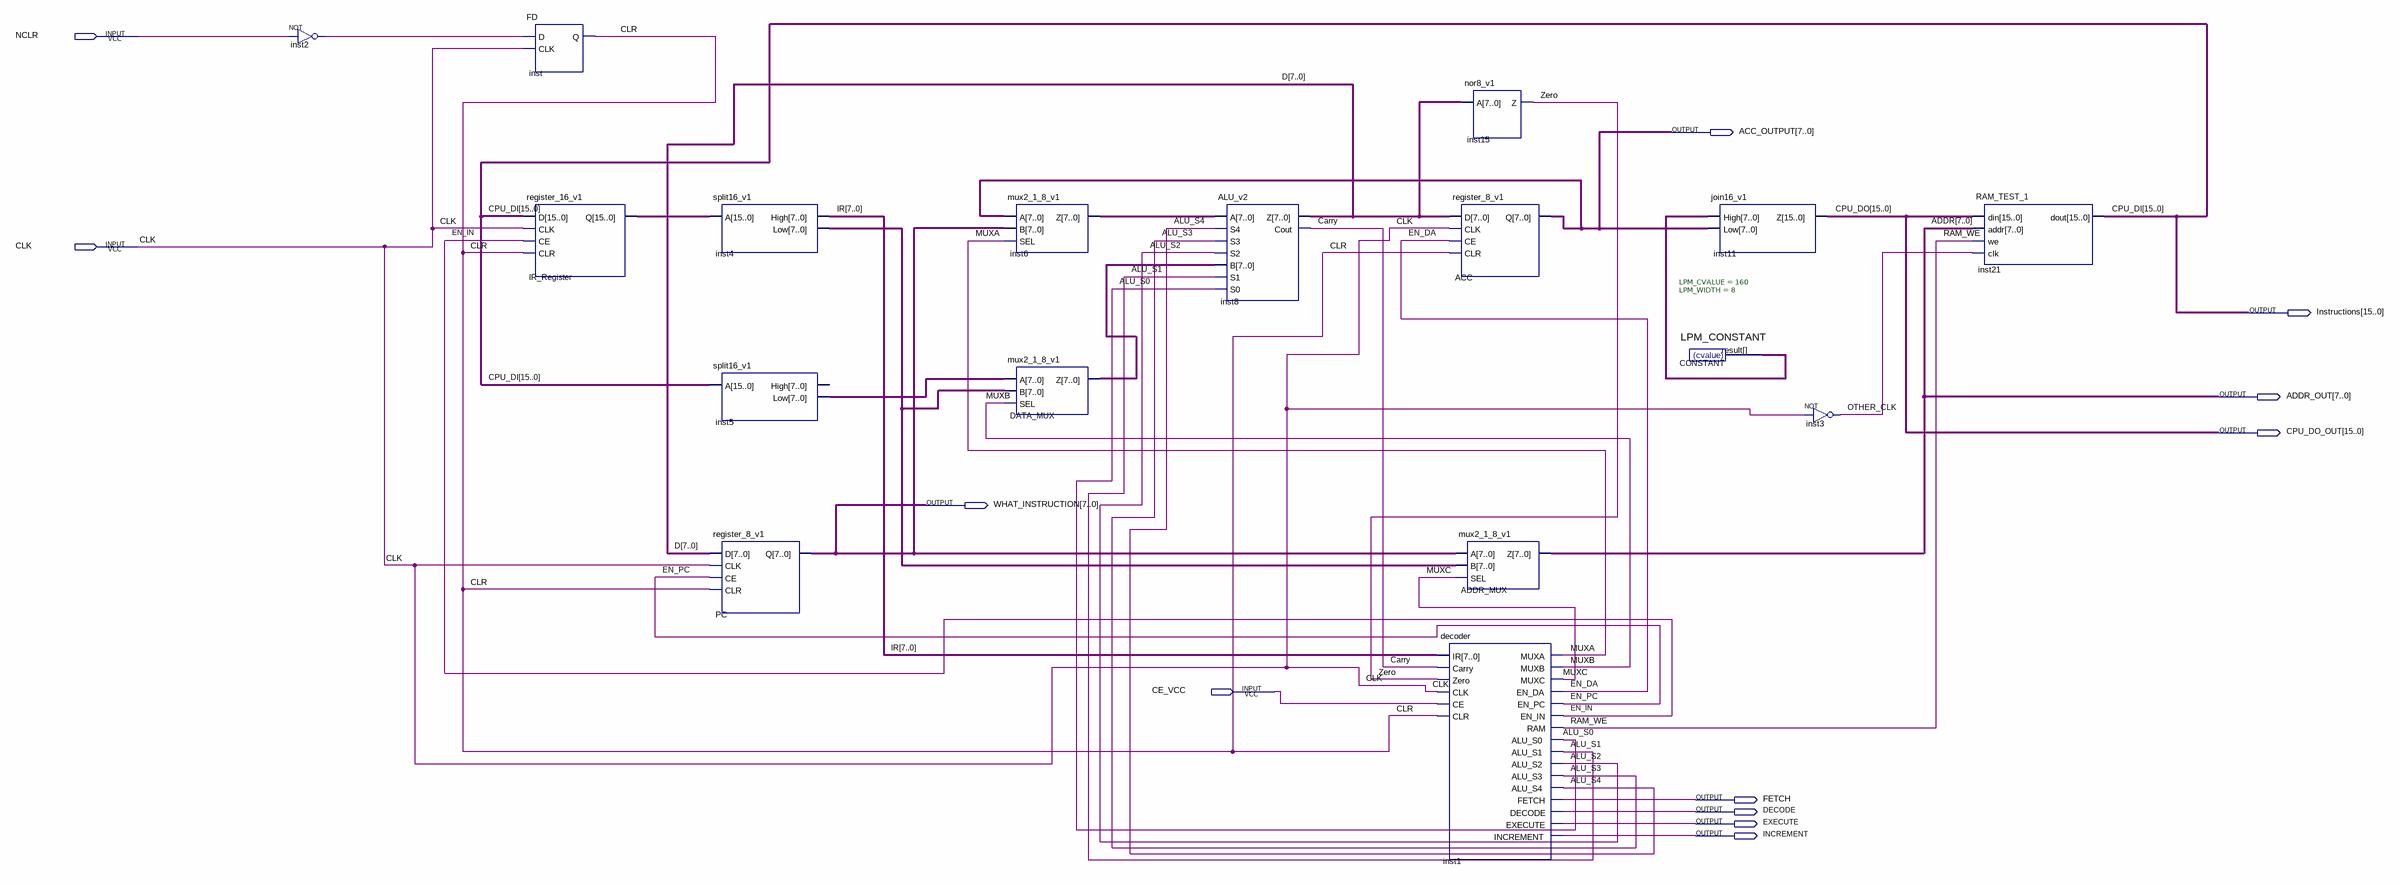
[diagram p0: schematic sheet]
// Quartus schematic top_level_v1.bdf as structural Verilog: 17 symbols, 12 pins
module top_level_v1 (
  input  NCLR,
  input  CLK,
  input  CE_VCC,
  output [7:0] ACC_OUTPUT,
  output [15:0] Instructions,
  output [7:0] ADDR_OUT,
  output [15:0] CPU_DO_OUT,
  output [7:0] WHAT_INSTRUCTION,
  output FETCH,
  output DECODE,
  output EXECUTE,
  output INCREMENT
);

  wire ALU_S0, ALU_S1, ALU_S2, ALU_S3, ALU_S4, Carry, CLR, EN_DA, EN_IN, EN_PC, inst2_out, MUXA, MUXB, MUXC,
       OTHER_CLK, RAM_WE, Zero;
  wire [7:0] CONSTANT_result, D, DATA_MUX_z, inst4_low, inst5_low, inst6_z, IR;
  wire [15:0] IR_Register_q;

  not inst2 (inst2_out, NCLR);
  FD inst (.D(inst2_out), .CLK(CLK), .Q(CLR));
  register_16_v1 IR_Register (.D(Instructions), .CLK(CLK), .CE(EN_IN), .CLR(CLR), .Q(IR_Register_q));
  split16_v1 inst4 (.A(IR_Register_q), .High(IR), .Low(inst4_low));
  split16_v1 inst5 (.A(Instructions), .Low(inst5_low));  // open: High
  register_8_v1 PC (.D(D), .CLK(CLK), .CE(EN_PC), .CLR(CLR), .Q(WHAT_INSTRUCTION));
  mux2_1_8_v1 inst6 (.A(ACC_OUTPUT), .B(WHAT_INSTRUCTION), .SEL(MUXA), .Z(inst6_z));
  mux2_1_8_v1 DATA_MUX (.A(inst5_low), .B(inst4_low), .SEL(MUXB), .Z(DATA_MUX_z));
  ALU_v2 inst8 (
    .A(inst6_z), .S4(ALU_S4), .S3(ALU_S3), .S2(ALU_S2), .B(DATA_MUX_z), .S1(ALU_S1), .S0(ALU_S0), .Z(D),
    .Cout(Carry));
  decoder inst1 (
    .IR(IR), .Carry(Carry), .Zero(Zero), .CLK(CLK), .CE(CE_VCC), .CLR(CLR), .MUXA(MUXA), .MUXB(MUXB),
    .MUXC(MUXC), .EN_DA(EN_DA), .EN_PC(EN_PC), .EN_IN(EN_IN), .RAM(RAM_WE), .ALU_S0(ALU_S0), .ALU_S1(ALU_S1),
    .ALU_S2(ALU_S2), .ALU_S3(ALU_S3), .ALU_S4(ALU_S4), .FETCH(FETCH), .DECODE(DECODE), .EXECUTE(EXECUTE),
    .INCREMENT(INCREMENT));
  nor8_v1 inst15 (.A(D), .Z(Zero));
  register_8_v1 ACC (.D(D), .CLK(CLK), .CE(EN_DA), .CLR(CLR), .Q(ACC_OUTPUT));
  mux2_1_8_v1 ADDR_MUX (.A(WHAT_INSTRUCTION), .B(inst4_low), .SEL(MUXC), .Z(ADDR_OUT));
  LPM_CONSTANT #(.LPM_CVALUE(160), .LPM_WIDTH(8)) CONSTANT (.result(CONSTANT_result));
  join16_v1 inst11 (.High(CONSTANT_result), .Low(ACC_OUTPUT), .Z(CPU_DO_OUT));
  not inst3 (OTHER_CLK, CLK);
  RAM_TEST_1 inst21 (.din(CPU_DO_OUT), .addr(ADDR_OUT), .we(RAM_WE), .clk(OTHER_CLK), .dout(Instructions));

  // Other names for the same wires on the sheet: ADDR[7:0] = ADDR_OUT; CPU_DI[15:0] = Instructions;
  //   CPU_DO[15:0] = CPU_DO_OUT
endmodule
